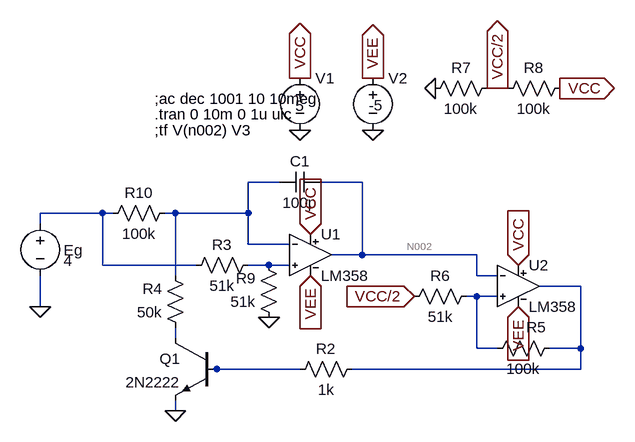
[diagram p0: schematic VCO-Datasheet.asc]
VCO-Datasheet.asc, the LTspice schematic file:
Version 4
SHEET 1 880 680
WIRE 608 -144 592 -144
WIRE 624 -144 608 -144
WIRE 272 0 224 0
WIRE 400 0 336 0
WIRE 0 48 -96 48
WIRE 16 48 0 48
WIRE 112 48 96 48
WIRE 224 48 224 0
WIRE 224 48 112 48
WIRE -96 64 -96 48
WIRE 224 96 224 48
WIRE 288 96 224 96
WIRE 400 112 400 0
WIRE 400 112 352 112
WIRE 576 112 400 112
WIRE 0 128 0 48
WIRE 144 128 0 128
WIRE 256 128 224 128
WIRE 288 128 256 128
WIRE 112 144 112 48
WIRE 576 144 576 112
WIRE 608 144 576 144
WIRE 736 160 672 160
WIRE 576 176 560 176
WIRE 608 176 576 176
WIRE -96 192 -96 144
WIRE 112 240 112 224
WIRE 576 256 576 176
WIRE 608 256 576 256
WIRE 736 256 736 160
WIRE 736 256 688 256
WIRE 176 288 160 288
WIRE 304 288 176 288
WIRE 736 288 736 256
WIRE 736 288 384 288
WIRE 112 352 112 336
FLAG -96 192 0
FLAG 304 -80 0
FLAG 416 -80 0
FLAG 304 -160 VCC
IOPIN 304 -160 Out
FLAG 416 -160 VEE
IOPIN 416 -160 Out
FLAG 320 80 VCC
IOPIN 320 80 In
FLAG 320 144 VEE
IOPIN 320 144 In
FLAG 112 352 0
FLAG 640 192 VEE
IOPIN 640 192 In
FLAG 640 128 VCC
IOPIN 640 128 In
FLAG 512 -144 0
FLAG 704 -144 VCC
IOPIN 704 -144 Out
FLAG 608 -144 VCC/2
IOPIN 608 -144 Out
FLAG 480 176 VCC/2
IOPIN 480 176 In
FLAG 256 208 0
SYMBOL voltage 304 -176 R0
WINDOW 123 0 0 Left 2
WINDOW 39 0 0 Left 2
WINDOW 3 -7 59 Left 2
SYMATTR InstName V1
SYMATTR Value 5
SYMBOL voltage 416 -176 R0
WINDOW 123 0 0 Left 2
WINDOW 39 0 0 Left 2
WINDOW 3 -6 58 Left 2
SYMATTR InstName V2
SYMATTR Value -5
SYMBOL voltage -96 48 R0
WINDOW 0 36 57 Left 2
WINDOW 3 36 73 Left 2
WINDOW 39 0 0 Left 2
SYMATTR InstName Eg
SYMATTR Value 4
SYMATTR Value2 AC 1
SYMBOL AutoGenerated\\LM358 320 48 R0
SYMATTR InstName U1
SYMBOL npn 176 240 M0
SYMATTR InstName Q1
SYMATTR Value 2N2222
SYMBOL AutoGenerated\\LM358 640 96 R0
SYMATTR InstName U2
SYMBOL res 240 112 R90
WINDOW 0 0 56 VBottom 2
WINDOW 3 32 56 VTop 2
SYMATTR InstName R3
SYMATTR Value 51k
SYMBOL res 128 240 R180
WINDOW 0 36 76 Left 2
WINDOW 3 36 40 Left 2
SYMATTR InstName R4
SYMATTR Value 50k
SYMBOL cap 336 -16 R90
WINDOW 0 0 32 VBottom 2
WINDOW 3 32 32 VTop 2
SYMATTR InstName C1
SYMATTR Value 100p
SYMBOL res 400 272 R90
WINDOW 0 0 56 VBottom 2
WINDOW 3 32 56 VTop 2
SYMATTR InstName R2
SYMATTR Value 1k
SYMBOL res 704 240 R90
WINDOW 0 -1 36 VBottom 2
WINDOW 3 32 56 VTop 2
SYMATTR InstName R5
SYMATTR Value 100k
SYMBOL res 576 160 R90
WINDOW 0 0 56 VBottom 2
WINDOW 3 32 56 VTop 2
SYMATTR InstName R6
SYMATTR Value 51k
SYMBOL res 608 -160 R90
WINDOW 0 0 56 VBottom 2
WINDOW 3 32 56 VTop 2
SYMATTR InstName R7
SYMATTR Value 100k
SYMBOL res 720 -160 R90
WINDOW 0 0 56 VBottom 2
WINDOW 3 32 56 VTop 2
SYMATTR InstName R8
SYMATTR Value 100k
SYMBOL res 272 224 R180
WINDOW 0 36 76 Left 2
WINDOW 3 36 40 Left 2
SYMATTR InstName R9
SYMATTR Value 51k
SYMBOL res 112 32 R90
WINDOW 0 0 56 VBottom 2
WINDOW 3 32 56 VTop 2
SYMATTR InstName R10
SYMATTR Value 100k
TEXT 80 -104 Left 2 !.tran 0 10m 0 1u uic
TEXT 80 -80 Left 2 !;tf V(n002) V3
TEXT 80 -128 Left 2 !;ac dec 1001 10 10meg

The netlist it stands for:
* VCO-Datasheet.asc
V1 VCC 0 5
V2 VEE 0 -5
V§Eg N003 0 4 AC 1
XU1 N004 N001 VCC VEE N002 LM358  ; pins In+ In- V+ V- OUT
Q1 N007 N008 0 0 2N2222
XU2 N006 N002 VCC VEE N005 LM358  ; pins In+ In- V+ V- OUT
R3 N004 N003 51k
R4 N007 N001 50k
C1 N002 N001 100p
R2 N005 N008 1k
R5 N005 N006 100k
R6 N006 VCC/2 51k
R7 VCC/2 0 100k
R8 VCC VCC/2 100k
R9 0 N004 51k
R10 N001 N003 100k
.model NPN NPN
.model PNP PNP
.lib standard.bjt
.tran 0 10m 0 1u uic
;tf V(n002) V3
;ac dec 1001 10 10meg
.lib LM358.lib
.backanno
.end

* Results of the author's LTspice run, read from the files saved beside the schematic
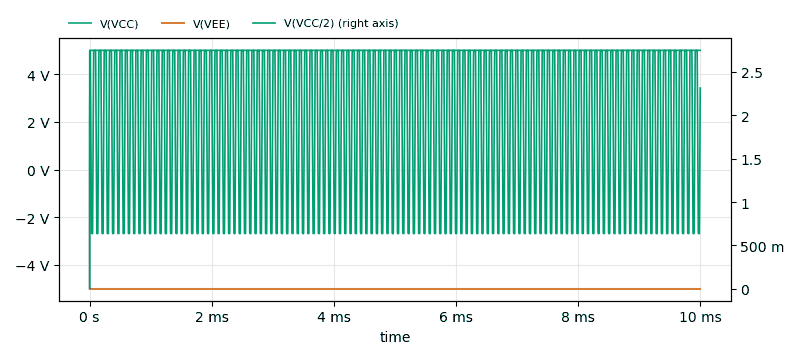
[diagram p1: Transient Analysis of VCO-Datasheet.asc, plotted from the saved traces]
* Transient Analysis, 1 run:
*   V(VCC): min 0 V, max 5 V, average 5 V, rms 5 V, last 5 V
*   V(VEE): min -5 V, max 0 V, average -5 V, rms 5 V, last -5 V
*   V(VCC/2): min 0, max 2.748 , average 1.863 , rms 2.063 , last 2.314 